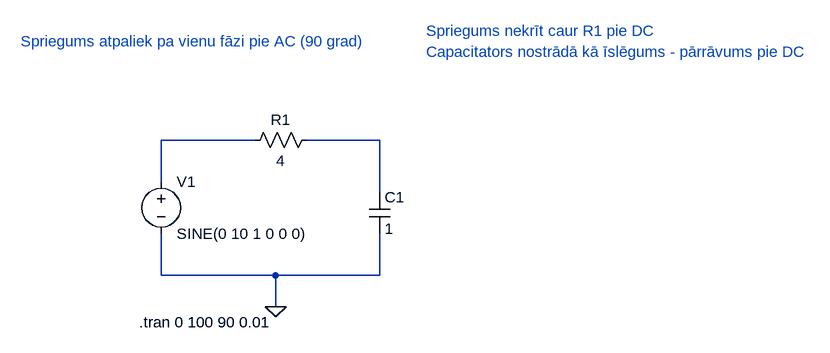
[diagram p0: schematic C(kapacitativs elements).asc]
C(kapacitativs elements).asc, the LTspice schematic file:
Version 4
SHEET 1 1044 680
WIRE 144 32 0 32
WIRE 336 32 224 32
WIRE 0 96 0 32
WIRE 336 112 336 32
WIRE 0 240 0 176
WIRE 176 240 0 240
WIRE 336 240 336 176
WIRE 336 240 176 240
WIRE 176 288 176 240
FLAG 176 288 0
SYMBOL voltage 0 80 R0
WINDOW 123 0 0 Left 0
WINDOW 39 0 0 Left 0
SYMATTR InstName V1
SYMATTR Value SINE(0 10 1 0 0 0)
SYMBOL cap 320 112 R0
SYMATTR InstName C1
SYMATTR Value 1
SYMATTR SpiceLine V=50 Irms=0 Rser=0 Lser=0
SYMBOL res 240 16 R90
WINDOW 0 0 56 VBottom 2
WINDOW 3 32 56 VTop 2
SYMATTR InstName R1
SYMATTR Value 4
TEXT -34 312 Left 2 !.tran 0 100 90 0.01
TEXT 408 -104 Left 2 ;Capacitators nostrādā kā īslēgums - pārrāvums pie DC
TEXT 408 -136 Left 2 ;Spriegums nekrīt caur R1 pie DC
TEXT -216 -120 Left 2 ;Spriegums atpaliek pa vienu fāzi pie AC (90 grad)

The netlist it stands for:
* C(kapacitativs elements).asc
V1 N001 0 SINE(0 10 1 0 0 0)
C1 N002 0 1 V=50 Irms=0 Rser=0 Lser=0
R1 N002 N001 4
.tran 0 100 90 0.01
* Capacitators nostrādā kā īslēgums - pārrāvums pie DC
* Spriegums nekrīt caur R1 pie DC
* Spriegums atpaliek pa vienu fāzi pie AC (90 grad)
.backanno
.end